# EAGLE design ifusb_l (EAGLE 7.2.0)
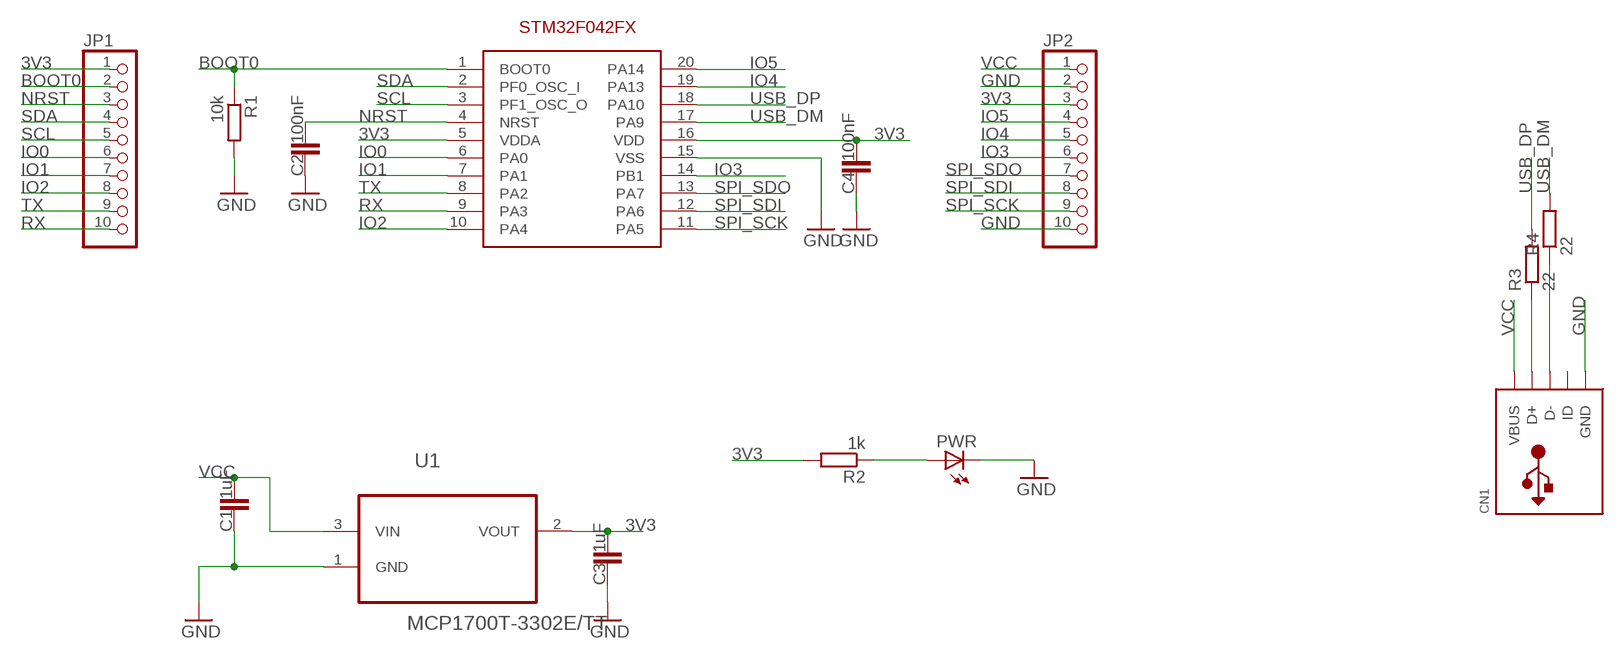
[diagram p0: schematic, sheet 1]

## Parts
C1  1uF  C-EUC0603K  [C0603K]
C2  100nF  C-EUC0603K  [C0603K]
C3  1uF  C-EUC0603K  [C0603K]
C4  100nF  C-EUC0603K  [C0603K]
CN1  USBMOLEX  [USB-MINIB-THM-MOLEX]
JP1  HEADER-1X10ROUND  [1X10_ROUND]
JP2  HEADER-1X10ROUND  [1X10_ROUND]
PWR  LEDCHIP-LED0603  [CHIP-LED0603]
R1  10k  R-EU_R0603  [R0603]
R2  1k  R-EU_R0603  [R0603]
R3  22  R-EU_R0603  [R0603]
R4  22  R-EU_R0603  [R0603]
U1  MCP1700T-3302E/TT  [SOT95P237X112-3N]
U2  STM32F042FX  [TSSOP20]

## Nets
3V3: C3.2 C4.2 JP1.1 JP2.3 R2.2 U1.2(VOUT) U2.5(VDDA) U2.16(VDD)
BOOT0: JP1.2 R1.1 U2.1(BOOT0)
GND: C1.1 C2.1 C3.1 C4.1 CN1.GND JP2.2 JP2.10 PWR.C R1.2 U1.1(GND) U2.15(VSS)
IO0: JP1.6 U2.6(PA0)
IO1: JP1.7 U2.7(PA1)
IO2: JP1.8 U2.10(PA4)
IO3: JP2.6 U2.14(PB1)
IO4: JP2.5 U2.19(PA13)
IO5: JP2.4 U2.20(PA14)
N$3: CN1.D+ R3.1
N$4: CN1.D- R4.1
N$5: PWR.A R2.1
NRST: C2.2 JP1.3 U2.4(NRST)
RX: JP1.10 U2.9(PA3)
SCL: JP1.5 U2.3(PF1_OSC_O)
SDA: JP1.4 U2.2(PF0_OSC_I)
SPI_SCK: JP2.9 U2.11(PA5)
SPI_SDI: JP2.8 U2.12(PA6)
SPI_SDO: JP2.7 U2.13(PA7)
TX: JP1.9 U2.8(PA2)
USB_DM: R4.2 U2.17(PA9)
USB_DP: R3.2 U2.18(PA10)
VCC: C1.2 CN1.VBUS JP2.1 U1.3(VIN)
Unconnected: CN1.ID

## Library data of the parts
C1-C4 = rcl:C-EU: CAPACITOR, European symbol
CN1 = adafruit:USB: USB Connectors USBMINIB - Surface Mount Female Mini-B USB Connector 4UConnector: 06564 By microbuilder.eu Thru-hole RA Female Mini-B USB Connector 4UConnector: 18732 By ladyada.net
JP1 JP2 = microbuilder:HEADER-1X10: PIN HEADER
PWR = led:LED: LED OSRAM: - CHIPLED LG R971, LG N971, LY N971, LG Q971, LY Q971, LO R971, LY R971 LH N974, LH R974 LS Q976, LO Q976, LY Q976 LO Q996 - Hyper CHIPLED LW Q18S LB Q993, LB Q99A, LB R99A - SideLED LS A670, LO A670, LY A670, LG A670, LP A670 LB A673, LV A673, LT A673, LW A673 LH A674 LY A675 LS A676, LA A676, LO A676, LY A676, LW A676 LS A679, LY A679, LG A679 - Hyper Micro SIDELED® LS Y876, LA Y876, LO Y876, LY Y876 LT Y87S - SmartLED LW L88C, LW L88S LB L89C, LB L89S, LG L890 LS L89K, LO L89K, LY L89K LS L896, LA L896, LO L896, LY L896 - TOPLED LS T670, LO T670, LY T670, LG T670, LP T670 LSG T670, LSP T670, LSY T670, LOP T670, LYG T670 LG T671, LOG T671, LSG T671 LB T673, LV T673, LT T673, LW T673 LH T674 LS T676, LA T676, LO T676, LY T676, LB T676, LH T676, LSB T676, LW T676 LB T67C, LV T67C, LT T67C, LS T67K, LO T67K, LY T67K, LW E67C LS E67B, LA E67B, LO E67B, LY E67B, LB E67C, LV E67C, LT E67C LW T67C LS T679, LY T679, LG T679 LS T770, LO T770, LY T770, LG T770, LP T770 LB T773, LV T773, LT T773, LW T773 LH T774 LS E675, LA E675, LY E675, LS T675 LS T776, LA T776, LO T776, LY T776, LB T776 LHGB T686 LT T68C, LB T68C - Hyper Mini TOPLED® LB M676 - Mini TOPLED Santana® LG M470 LS M47K, LO M47K, LY M47K Source: http://www.osram.convergy.de LUXEON: - LUMILED® LXK2-PW12-R00, LXK2-PW12-S00, LXK2-PW14-U00, LXK2-PW14-V00 LXK2-PM12-R00, LXK2-PM12-S00, LXK2-PM14-U00 LXK2-PE12-Q00, LXK2-PE12-R00, LXK2-PE12-S00, LXK2-PE14-T00, LXK2-PE14-U00 LXK2-PB12-K00, LXK2-PB12-L00, LXK2-PB12-M00, LXK2-PB14-N00, LXK2-PB14-P00, LXK2-PB14-Q00 LXK2-PR12-L00, LXK2-PR12-M00, LXK2-PR14-Q00, LXK2-PR14-R00 LXK2-PD12-Q00, LXK2-PD12-R00, LXK2-PD12-S00 LXK2-PH12-R00, LXK2-PH12-S00 LXK2-PL12-P00, LXK2-PL12-Q00, LXK2-PL12-R00 Source: www.luxeon.com KINGBRIGHT: KA-3528ASYC Source: www.kingbright.com
R1-R4 = rcl:R-EU_: RESISTOR, European symbol
U1 = Microchip_By_element14_Batch_1:MCP1700T-3302E/TT: Low Quiescent Current LDO; MPN: MCP1700T-3302E/TT; OC_FARNELL: 1296592; OC_NEWARK: 88H9817; PACKAGE: SOT23-3; SUPPLIER: Microchip
U2 = STM32F042Fx:STM32F042FX: STM32F042Fx microcontroller

## Net classes
1 GND: width 0.305 mm
2 VCC: width 0.305 mm

## Board
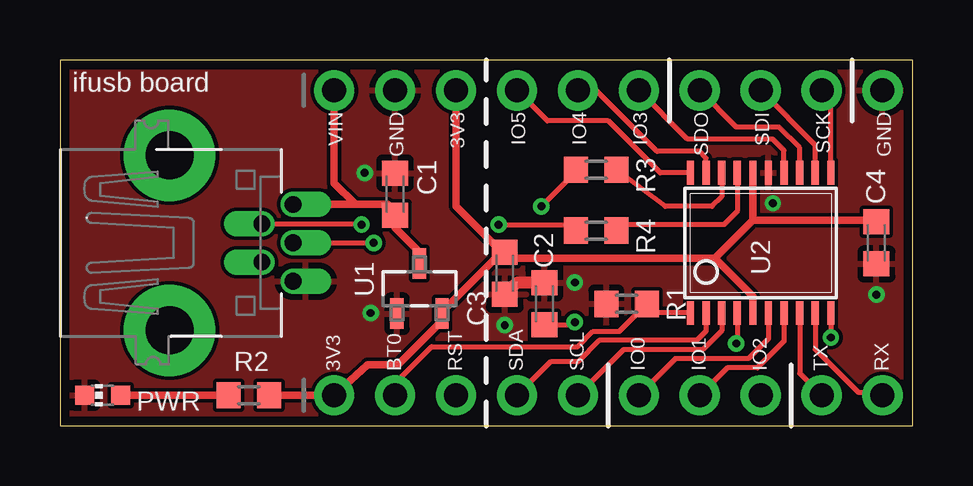
[diagram p1: board, top side]
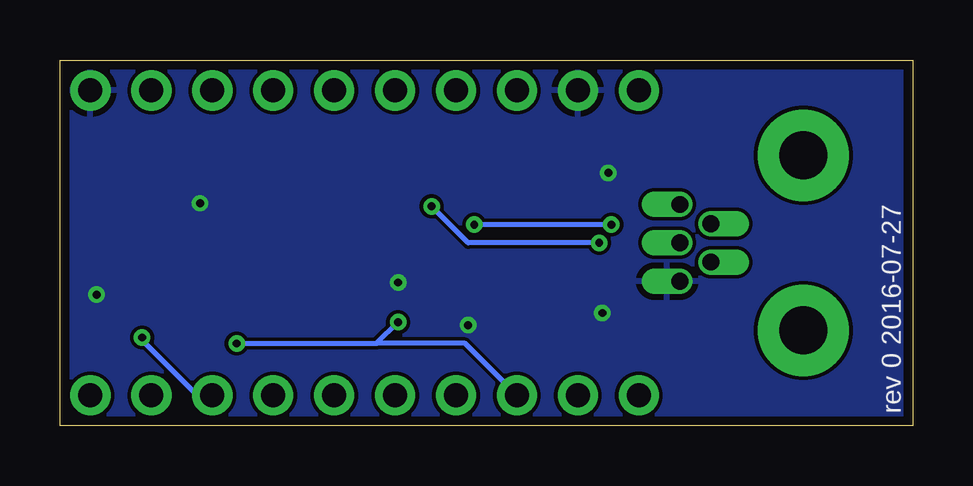
[diagram p2: board, bottom side, seen from below]

Size 35.56 x 15.24 mm. Coordinates in mm from the lower left corner, seen from the top.
Outline: 0,0 35.56,0 35.56,15.24 0,15.24 0,0
Copper layers (1*16): Top 0.0356mm / dielectric 1.5011mm / Bottom 0.0356mm
Design rules "LaenPCBOrder": minimum track width 6mil, minimum drill 13mil, track to track 6mil, track to pad 6mil, pad to pad 6mil, via to via 6mil, smd to smd 6mil, copper to edge 15mil, drill to drill 6mil, minimum pad ring 7mil, minimum via ring 7mil, stop-mask expansion 3mil, vias tented up to drill 0mil, thermal gap 10mil

### Footprints (pad centres in the part's own frame; a part is rotated, then mirrored left to right if it is on the bottom)
C0603K = smd 1.05 x 1.08: 1 -0.875,0; 2 0.875,0
USB-MINIB-THM-MOLEX = drill 0.7 offset: D+ 0,9.72; D- -0.8,8.42; GND 1.6,9.72; ID 0.8,8.42; VBUS -1.6,9.72 | drill 2 pad 3.81: GND1 -3.65,4.57; GND4 3.65,4.57
1X10_ROUND = drill 1 pad 1.676: 1 -11.43,0; 2 -8.89,0; 3 -6.35,0; 4 -3.81,0; 5 -1.27,0; 6 1.27,0; 7 3.81,0; 8 6.35,0; 9 8.89,0; 10 11.43,0
CHIP-LED0603 = smd 0.8 x 0.8: A 0,-0.75; C 0,0.75
R0603 = smd 1 x 1.1: 1 -0.85,0; 2 0.85,0
SOT95P237X112-3N = smd 0.559 x 1.27: 1 -0.94,-1.041; 2 0.94,-1.041; 3 0,1.041
TSSOP20 = smd 0.305 x 0.991: 1 -2.925,-2.918; 2 -2.275,-2.918; 3 -1.625,-2.918; 4 -0.975,-2.918; 5 -0.325,-2.918; 6 0.325,-2.918; 7 0.975,-2.918; 8 1.625,-2.918; 9 2.275,-2.918; 10 2.925,-2.918; 11 2.925,2.918; 12 2.275,2.918; 13 1.625,2.918; 14 0.975,2.918; 15 0.325,2.918; 16 -0.325,2.918; 17 -0.975,2.918; 18 -1.625,2.918; 19 -2.275,2.918; 20 -2.925,2.918

### Placement (x,y rotation side)
C1  13.97,9.65 270 top
C2  20.19,5.08 270 top
C3  18.54,6.35 90 top
C4  34.04,7.62 90 top
CN1  0,7.62 270 top
JP1  22.86,1.27 0 top
JP2  22.86,13.97 0 top
PWR  1.78,1.27 90 top
R1  23.62,5.08 180 top
R2  7.87,1.27 0 top
R3  22.35,10.67 0 top
R4  22.35,8.13 0 top
U1  14.99,5.71 0 top
U2  29.21,7.62 0 top

### Tracks (layer width: path | path; a pad name or v marks a point on that pad's centre or on a via)
3V3
  Top 0.305: 27.3,6.99 28.89,8.56 | U2.16 28.89,8.56 | U2.5 28.89,5.41 27.3,6.99 | 28.89,8.56 33.85,8.56 C4.2 | JP2.3 16.51,9.14 18.54,7.11 C3.2 | R2.2 JP1.1 12.83,2.54 14.1,2.54 15.93,4.37 U1.2 15.93,4.75 18.4,7.22 C3.2 | C3.2 18.66,7.1 18.8,6.99 27.3,6.99
BOOT0
  Top 0.203: JP1.2 13.97,1.78 15.49,3.3 21.59,3.3 22.23,3.94 23.33,3.94 R1.1 24.85,4.7 U2.1
GND  (via drill 0.33)
  Top 0.508: C2.1 19.02,5.96 C3.1
  other vias: 18.54,4.19 12.95,4.7 12.7,10.54 34.04,5.46 29.72,9.27 21.46,5.97
  pour Top: -12.7,30.48 -12.7,-15.24 53.34,-15.24 53.34,30.48
  pour Bottom: -7.62,25.4 -7.62,-10.16 48.26,-10.16 48.26,25.4
IO0
  Top 0.203: U2.6 29.54,3.63 28.7,2.79 25.65,2.79 JP1.6
IO1
  Top 0.203: U2.7 30.18,3.52 29.08,2.41 27.81,2.41 JP1.7
IO2  (via drill 0.33)
  Top 0.203: U2.10 v32.13,3.68
  Bottom 0.203: v32.13,3.68 32.13,3.56 29.84,1.27 JP1.8
IO3
  Top 0.203: U2.14 30.18,11.47 29.72,11.94 26.16,11.94 JP2.6
IO4
  Top 0.203: U2.19 26.93,11.16 26.67,11.43 24.89,11.43 22.35,13.97 JP2.5
IO5
  Top 0.203: U2.20 25.02,10.54 22.86,12.7 20.32,12.7 JP2.4
N$3  (via drill 0.33)
  Top 0.203: CN1.D+ v13.08,7.62 | v20.07,9.14 21.59,10.67 R3.1
  Bottom 0.203: v13.08,7.62 18.54,7.62 v20.07,9.14
N$4  (via drill 0.33)
  Top 0.203: CN1.D- 12.66,8.42 v12.57,8.38 | v18.29,8.38 21.84,8.38 R4.1
  Bottom 0.203: v12.57,8.38 v18.29,8.38
N$5
  Top 0.305: R2.1 PWR.A
NRST  (via drill 0.33)
  Top 0.203: U2.4 28.23,3.47 v28.19,3.43 | C2.2 21.32,4.21 v21.46,4.32
  Bottom 0.203: v28.19,3.43 22.61,3.43 22.35,3.43 | v21.46,4.32 22.35,3.43 | JP1.3 18.67,3.43 22.35,3.43
RX
  Top 0.203: U2.9 31.48,3.19 33.27,1.4 34.16,1.4 JP1.10
SCL
  Top 0.203: U2.3 27.59,3.96 26.8,3.17 23.5,3.17 JP1.5
SDA
  Top 0.203: U2.2 26.93,3.95 26.54,3.56 22.48,3.56 21.59,2.67 20.45,2.67 JP1.4
SPI_SCK
  Top 0.203: U2.11 32.13,13.59 JP2.9
SPI_SDI
  Top 0.203: U2.12 31.48,11.7 JP2.8
SPI_SDO
  Top 0.203: U2.13 30.84,11.58 29.97,12.45 28.19,12.45 JP2.7
TX
  Top 0.203: U2.8 30.84,2.19 JP1.9
USB_DM
  Top 0.203: U2.17 28.23,8.93 27.69,8.38 23.62,8.38 R4.2
USB_DP
  Top 0.203: U2.18 27.59,9.55 27.18,9.14 25.23,9.14 R3.2
VCC
  Top 0.305: CN1.VBUS 12.32,9.22 | 12.32,9.22 13.65,9.22 C1.2 | 14.05,8.96 C1.2 | JP2.1 11.43,10.11 12.32,9.22 | U1.3 14.99,7.24 13.97,8.26 C1.2

### Text on the board
tNames: ifusb board | VIN | GND | 3V3 | IO5 | IO4 | IO3 | SDO | SDI | SCK | GND | 3V3 | BT0 | RST | SDA | SCL | IO0 | IO1 | IO2 | TX | RX
bNames: rev 0 2016-07-27